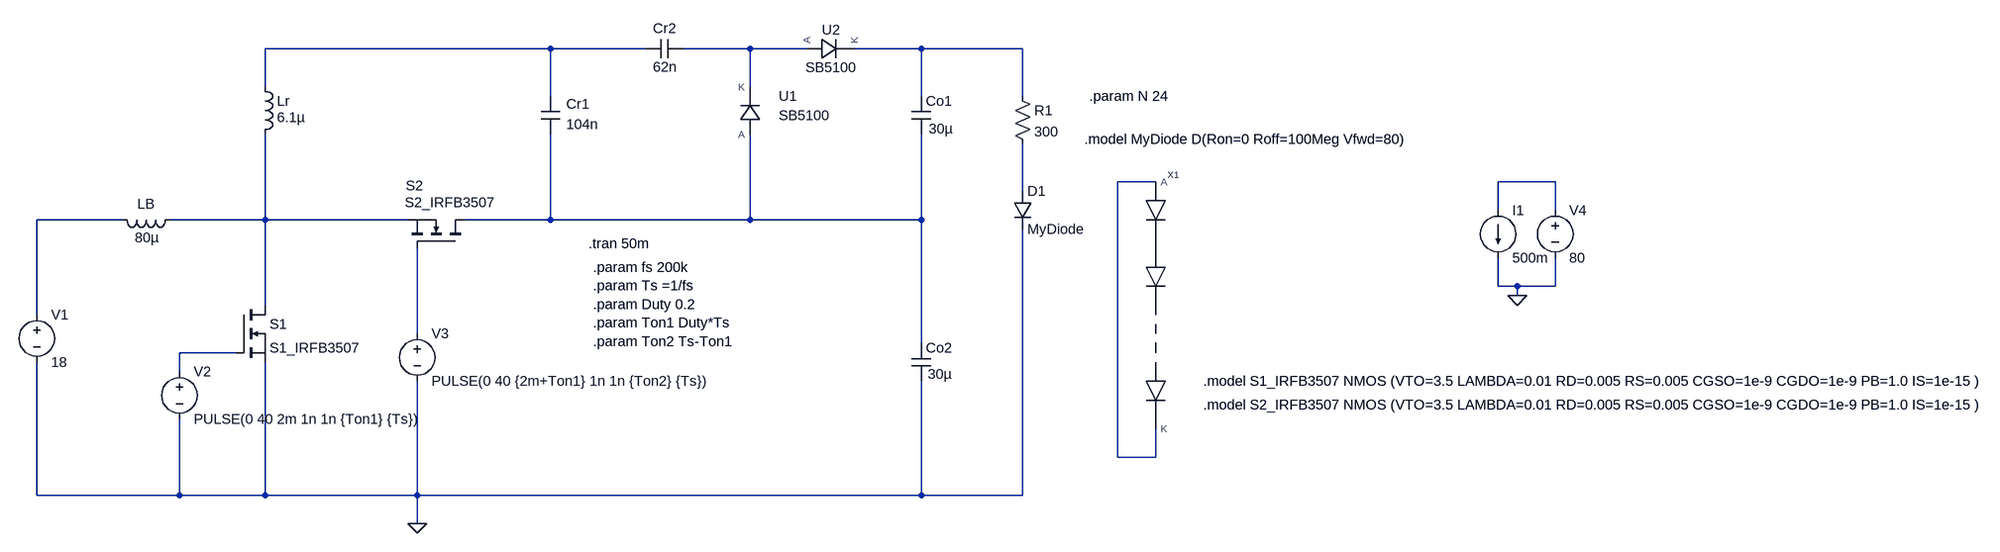
[diagram p0: schematic reale - componenti diversi - funzionante - 3.asc]
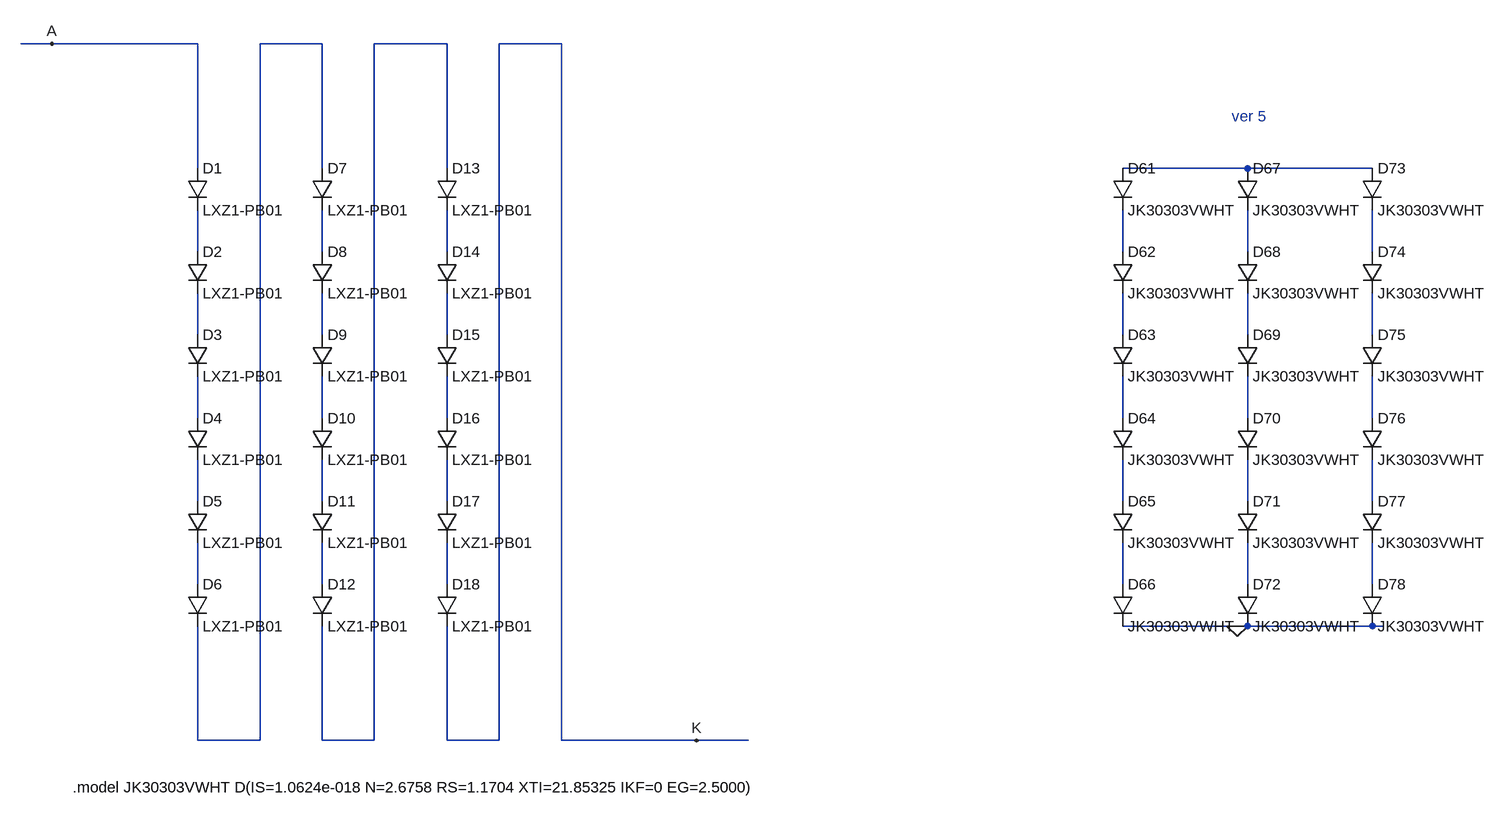
[diagram p1: sub-circuit led_strip.asc]
reale - componenti diversi - funzionante - 3.asc, the LTspice schematic file:
Version 4.1
SHEET 1 3424 2144
WIRE 352 -128 -128 -128
WIRE 512 -128 352 -128
WIRE 688 -128 576 -128
WIRE 784 -128 688 -128
WIRE 976 -128 864 -128
WIRE 1360 -128 976 -128
WIRE -128 -64 -128 -128
WIRE 688 -64 688 -128
WIRE 352 -48 352 -128
WIRE 976 -48 976 -128
WIRE 1360 -48 1360 -128
WIRE 1584 96 1520 96
WIRE 2256 96 2160 96
WIRE 1360 112 1360 32
WIRE 2160 144 2160 96
WIRE 2256 144 2256 96
WIRE -368 160 -512 160
WIRE -128 160 -128 16
WIRE -128 160 -288 160
WIRE 112 160 -128 160
WIRE 352 160 352 16
WIRE 352 160 208 160
WIRE 688 160 688 16
WIRE 688 160 352 160
WIRE 976 160 976 16
WIRE 976 160 688 160
WIRE 2160 272 2160 224
WIRE 2192 272 2160 272
WIRE 2256 272 2256 224
WIRE 2256 272 2192 272
WIRE 2192 288 2192 272
WIRE -128 304 -128 160
WIRE -512 320 -512 160
WIRE 128 352 128 208
WIRE 976 368 976 160
WIRE -176 384 -272 384
WIRE -272 416 -272 384
WIRE 1520 560 1520 96
WIRE 1584 560 1584 512
WIRE 1584 560 1520 560
WIRE -512 624 -512 400
WIRE -272 624 -272 496
WIRE -272 624 -512 624
WIRE -128 624 -128 400
WIRE -128 624 -272 624
WIRE 128 624 128 432
WIRE 128 624 -128 624
WIRE 976 624 976 432
WIRE 976 624 128 624
WIRE 1360 624 1360 176
WIRE 1360 624 976 624
WIRE 128 672 128 624
FLAG 128 672 0
FLAG 2192 288 0
SYMBOL cap 336 -48 R0
WINDOW 0 43 13 Left 2
WINDOW 3 43 47 Left 2
SYMATTR InstName Cr1
SYMATTR Value 104n
SYMBOL cap 576 -144 R90
WINDOW 0 -3 32 VBottom 2
WINDOW 3 62 31 VBottom 2
SYMATTR InstName Cr2
SYMATTR Value 62n
SYMBOL cap 960 -48 R0
WINDOW 3 29 55 Left 2
SYMATTR Value 30µ
SYMATTR InstName Co1
SYMBOL cap 960 368 R0
WINDOW 3 27 52 Left 2
SYMATTR Value 30µ
SYMATTR InstName Co2
SYMBOL ind -144 -80 R0
WINDOW 3 36 68 Left 2
SYMATTR Value 6.1µ
SYMATTR InstName Lr
SYMBOL ind -272 144 R90
WINDOW 0 5 56 VBottom 2
WINDOW 3 62 55 VBottom 2
SYMATTR InstName LB
SYMATTR Value 80µ
SYMBOL voltage -512 304 R0
WINDOW 123 0 0 Left 0
WINDOW 39 0 0 Left 0
SYMATTR InstName V1
SYMATTR Value 18
SYMBOL nmos -176 304 R0
SYMATTR InstName S1
SYMATTR Value S1_IRFB3507
SYMBOL nmos 208 208 M270
WINDOW 0 105 99 VLeft 2
WINDOW 3 77 101 VLeft 2
SYMATTR InstName S2
SYMATTR Value S2_IRFB3507
SYMBOL voltage -272 400 R0
WINDOW 123 0 0 Left 0
WINDOW 39 0 0 Left 0
SYMATTR InstName V2
SYMATTR Value PULSE(0 40 2m 1n 1n {Ton1} {Ts})
SYMBOL voltage 128 336 R0
WINDOW 123 0 0 Left 0
WINDOW 39 0 0 Left 0
SYMATTR InstName V3
SYMATTR Value PULSE(0 40 {2m+Ton1} 1n 1n {Ton2} {Ts})
SYMBOL DATASHEET\\sb5100\\sb5100 688 -16 R0
SYMATTR InstName U1
SYMBOL DATASHEET\\sb5100\\sb5100 816 -128 R90
WINDOW 0 -16 -8 VBottom 2
WINDOW 3 16 -8 VTop 2
SYMATTR InstName U2
SYMBOL LED_strip 1584 128 R0
SYMATTR InstName X1
SYMBOL voltage 2256 128 R0
WINDOW 123 0 0 Left 0
WINDOW 39 0 0 Left 0
SYMATTR InstName V4
SYMATTR Value 80
SYMBOL current 2160 144 R0
WINDOW 123 0 0 Left 0
WINDOW 39 0 0 Left 0
SYMATTR InstName I1
SYMATTR Value 500m
SYMBOL diode 1344 112 R0
SYMATTR InstName D1
SYMATTR Value MyDiode
SYMBOL res 1344 -64 R0
SYMATTR InstName R1
SYMATTR Value 300
TEXT 416 200 Left 2 !.tran 50m
TEXT 424 240 Left 2 !.param fs 200k\n.param Ts =1/fs\n.param Duty 0.2\n.param Ton1 Duty*Ts\n.param Ton2 Ts-Ton1
TEXT 1472 -48 Left 2 !.param N 24
TEXT 1464 24 Left 2 !.model MyDiode D(Ron=0 Roff=100Meg Vfwd=80)
TEXT 1664 432 Left 2 !.model S1_IRFB3507 NMOS (VTO=3.5 LAMBDA=0.01 RD=0.005 RS=0.005 CGSO=1e-9 CGDO=1e-9 PB=1.0 IS=1e-15 )
TEXT 1664 472 Left 2 !.model S2_IRFB3507 NMOS (VTO=3.5 LAMBDA=0.01 RD=0.005 RS=0.005 CGSO=1e-9 CGDO=1e-9 PB=1.0 IS=1e-15 )

led_strip.asc, the sub-circuit schematic file:
Version 4.1
SHEET 1 4488 1172
WIRE 16 -16 -32 -16
WIRE 240 -16 16 -16
WIRE 432 -16 336 -16
WIRE 624 -16 512 -16
WIRE 800 -16 704 -16
WIRE 240 176 240 -16
WIRE 432 176 432 -16
WIRE 624 176 624 -16
WIRE 1856 176 1664 176
WIRE 2048 176 1856 176
WIRE 240 304 240 240
WIRE 432 304 432 240
WIRE 624 304 624 240
WIRE 1664 304 1664 240
WIRE 1856 304 1856 240
WIRE 2048 304 2048 240
WIRE 240 432 240 368
WIRE 432 432 432 368
WIRE 624 432 624 368
WIRE 1664 432 1664 368
WIRE 1856 432 1856 368
WIRE 2048 432 2048 368
WIRE 240 560 240 496
WIRE 432 560 432 496
WIRE 624 560 624 496
WIRE 1664 560 1664 496
WIRE 1856 560 1856 496
WIRE 2048 560 2048 496
WIRE 240 688 240 624
WIRE 432 688 432 624
WIRE 624 688 624 624
WIRE 1664 688 1664 624
WIRE 1856 688 1856 624
WIRE 2048 688 2048 624
WIRE 240 816 240 752
WIRE 432 816 432 752
WIRE 624 816 624 752
WIRE 1664 816 1664 752
WIRE 1856 816 1856 752
WIRE 2048 816 2048 752
WIRE 1840 880 1664 880
WIRE 1856 880 1840 880
WIRE 2048 880 1856 880
WIRE 2064 880 2048 880
WIRE 240 1056 240 880
WIRE 336 1056 336 -16
WIRE 336 1056 240 1056
WIRE 432 1056 432 880
WIRE 512 1056 512 -16
WIRE 512 1056 432 1056
WIRE 624 1056 624 880
WIRE 704 1056 704 -16
WIRE 704 1056 624 1056
WIRE 800 1056 800 -16
WIRE 1008 1056 800 1056
WIRE 1088 1056 1008 1056
FLAG 16 -16 A
FLAG 1008 1056 K
FLAG 1840 880 0
SYMBOL diode 1648 176 R0
SYMATTR InstName D61
SYMATTR Value JK30303VWHT
SYMBOL diode 1648 304 R0
SYMATTR InstName D62
SYMATTR Value JK30303VWHT
SYMBOL diode 1648 432 R0
SYMATTR InstName D63
SYMATTR Value JK30303VWHT
SYMBOL diode 1648 560 R0
SYMATTR InstName D64
SYMATTR Value JK30303VWHT
SYMBOL diode 1648 688 R0
SYMATTR InstName D65
SYMATTR Value JK30303VWHT
SYMBOL diode 1648 816 R0
SYMATTR InstName D66
SYMATTR Value JK30303VWHT
SYMBOL diode 1840 176 R0
SYMATTR InstName D67
SYMATTR Value JK30303VWHT
SYMBOL diode 1840 304 R0
SYMATTR InstName D68
SYMATTR Value JK30303VWHT
SYMBOL diode 1840 432 R0
SYMATTR InstName D69
SYMATTR Value JK30303VWHT
SYMBOL diode 1840 560 R0
SYMATTR InstName D70
SYMATTR Value JK30303VWHT
SYMBOL diode 1840 688 R0
SYMATTR InstName D71
SYMATTR Value JK30303VWHT
SYMBOL diode 1840 816 R0
SYMATTR InstName D72
SYMATTR Value JK30303VWHT
SYMBOL diode 2032 176 R0
SYMATTR InstName D73
SYMATTR Value JK30303VWHT
SYMBOL diode 2032 304 R0
SYMATTR InstName D74
SYMATTR Value JK30303VWHT
SYMBOL diode 2032 432 R0
SYMATTR InstName D75
SYMATTR Value JK30303VWHT
SYMBOL diode 2032 560 R0
SYMATTR InstName D76
SYMATTR Value JK30303VWHT
SYMBOL diode 2032 688 R0
SYMATTR InstName D77
SYMATTR Value JK30303VWHT
SYMBOL diode 2032 816 R0
SYMATTR InstName D78
SYMATTR Value JK30303VWHT
SYMBOL diode 224 176 R0
SYMATTR InstName D1
SYMATTR Value LXZ1-PB01
SYMBOL diode 224 304 R0
SYMATTR InstName D2
SYMATTR Value LXZ1-PB01
SYMBOL diode 224 432 R0
SYMATTR InstName D3
SYMATTR Value LXZ1-PB01
SYMBOL diode 224 560 R0
SYMATTR InstName D4
SYMATTR Value LXZ1-PB01
SYMBOL diode 224 688 R0
SYMATTR InstName D5
SYMATTR Value LXZ1-PB01
SYMBOL diode 224 816 R0
SYMATTR InstName D6
SYMATTR Value LXZ1-PB01
SYMBOL diode 416 176 R0
SYMATTR InstName D7
SYMATTR Value LXZ1-PB01
SYMBOL diode 416 304 R0
SYMATTR InstName D8
SYMATTR Value LXZ1-PB01
SYMBOL diode 416 432 R0
SYMATTR InstName D9
SYMATTR Value LXZ1-PB01
SYMBOL diode 416 560 R0
SYMATTR InstName D10
SYMATTR Value LXZ1-PB01
SYMBOL diode 416 688 R0
SYMATTR InstName D11
SYMATTR Value LXZ1-PB01
SYMBOL diode 416 816 R0
SYMATTR InstName D12
SYMATTR Value LXZ1-PB01
SYMBOL diode 608 176 R0
SYMATTR InstName D13
SYMATTR Value LXZ1-PB01
SYMBOL diode 608 304 R0
SYMATTR InstName D14
SYMATTR Value LXZ1-PB01
SYMBOL diode 608 432 R0
SYMATTR InstName D15
SYMATTR Value LXZ1-PB01
SYMBOL diode 608 560 R0
SYMATTR InstName D16
SYMATTR Value LXZ1-PB01
SYMBOL diode 608 688 R0
SYMATTR InstName D17
SYMATTR Value LXZ1-PB01
SYMBOL diode 608 816 R0
SYMATTR InstName D18
SYMATTR Value LXZ1-PB01
TEXT 48 1128 Left 2 !.model JK30303VWHT D(IS=1.0624e-018 N=2.6758 RS=1.1704 XTI=21.85325 IKF=0 EG=2.5000)
TEXT 1832 96 Left 2 ;ver 5

The netlist it stands for:
* reale - componenti diversi - funzionante - 3.asc
Cr1 N001 N009 104n
Cr2 N002 N001 62n
Co1 N003 N009 30µ
Co2 N009 0 30µ
Lr N001 N008 6.1µ
LB N008 N007 80µ
V1 N007 0 18
M§S1 N008 N011 0 0 S1_IRFB3507
M§S2 N009 N010 N008 N008 S2_IRFB3507
V2 N011 0 PULSE(0 40 2m 1n 1n {Ton1} {Ts})
V3 N010 0 PULSE(0 40 {2m+Ton1} 1n 1n {Ton2} {Ts})
X§U1 N009 N002 SB5100  ; pins A K
X§U2 N002 N003 SB5100  ; pins A K
X§X1 N004 N004 led_strip
V4 N005 0 80
I1 N005 0 500m
D1 N006 0 MyDiode
R1 N003 N006 300

* block symbol definitions
.subckt led_strip A K
D61 N003 N007 JK30303VWHT
D62 N007 N013 JK30303VWHT
D63 N013 N019 JK30303VWHT
D64 N019 N025 JK30303VWHT
D65 N025 N031 JK30303VWHT
D66 N031 0 JK30303VWHT
D67 N003 N008 JK30303VWHT
D68 N008 N014 JK30303VWHT
D69 N014 N020 JK30303VWHT
D70 N020 N026 JK30303VWHT
D71 N026 N032 JK30303VWHT
D72 N032 0 JK30303VWHT
D73 N003 N009 JK30303VWHT
D74 N009 N015 JK30303VWHT
D75 N015 N021 JK30303VWHT
D76 N021 N027 JK30303VWHT
D77 N027 N033 JK30303VWHT
D78 N033 0 JK30303VWHT
D1 A N004 LXZ1-PB01
D2 N004 N010 LXZ1-PB01
D3 N010 N016 LXZ1-PB01
D4 N016 N022 LXZ1-PB01
D5 N022 N028 LXZ1-PB01
D6 N028 N001 LXZ1-PB01
D7 N001 N005 LXZ1-PB01
D8 N005 N011 LXZ1-PB01
D9 N011 N017 LXZ1-PB01
D10 N017 N023 LXZ1-PB01
D11 N023 N029 LXZ1-PB01
D12 N029 N002 LXZ1-PB01
D13 N002 N006 LXZ1-PB01
D14 N006 N012 LXZ1-PB01
D15 N012 N018 LXZ1-PB01
D16 N018 N024 LXZ1-PB01
D17 N024 N030 LXZ1-PB01
D18 N030 K LXZ1-PB01
.model JK30303VWHT D(IS=1.0624e-018 N=2.6758 RS=1.1704 XTI=21.85325 IKF=0 EG=2.5000)
* ver 5
.ends led_strip

.model D D
.lib standard.dio
.model NMOS NMOS
.model PMOS PMOS
.lib standard.mos
.tran 50m
.param fs 200k
.param Ts =1/fs
.param Duty 0.2
.param Ton1 Duty*Ts
.param Ton2 Ts-Ton1
.param N 24
.model MyDiode D(Ron=0 Roff=100Meg Vfwd=80)
.model S1_IRFB3507 NMOS (VTO=3.5 LAMBDA=0.01 RD=0.005 RS=0.005 CGSO=1e-9 CGDO=1e-9 PB=1.0 IS=1e-15 )
.model S2_IRFB3507 NMOS (VTO=3.5 LAMBDA=0.01 RD=0.005 RS=0.005 CGSO=1e-9 CGDO=1e-9 PB=1.0 IS=1e-15 )
.lib .\sb5100_spice.lib
.lib "G:\Il mio Drive\00 UNIBS\MAGISTRALE\ANNO 2 - 2° semestre\ELETTRONICA DI POTENZA\_progetto_mio\DATASHEET\led osram\LED_strip.lib"
.backanno
.end